# Altium schematic sheet Led RGB.SchDoc
size A4; SheetNumber: 4; SheetTotal: 5
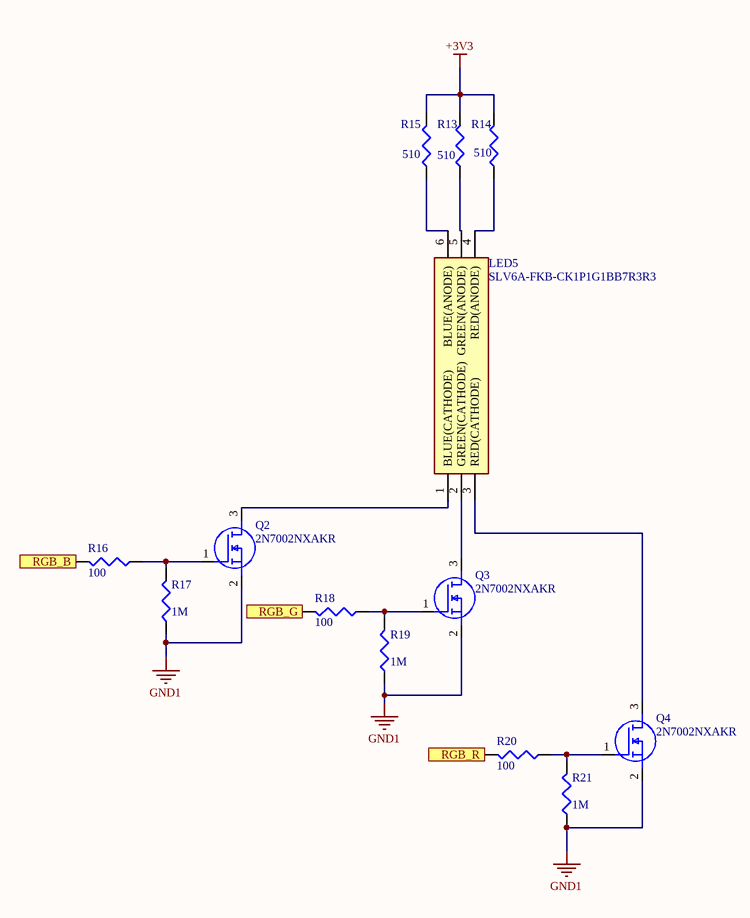
[diagram p0: Led RGB.SchDoc]

## Parts
LED5  SLV6A-FKB-CK1P1G1BB7R3R3  [SLV6AFKBCKNPRGJBB7A363]
Q2  2N7002NXAKR  [SOT95P230X110-3N]
Q3  2N7002NXAKR  [SOT95P230X110-3N]
Q4  2N7002NXAKR  [SOT95P230X110-3N]
R13  value 510  [J1-0603]  (hidden comment: Res3)
R14  value 510  [J1-0603]  (hidden comment: Res3)
R15  value 510  [J1-0603]  (hidden comment: Res3)
R16  value 100  [J1-0603]  (hidden comment: Res3)
R17  value 1M  [J1-0603]  (hidden comment: Res3)
R18  value 100  [J1-0603]  (hidden comment: Res3)
R19  value 1M  [J1-0603]  (hidden comment: Res3)
R20  value 100  [J1-0603]  (hidden comment: Res3)
R21  value 1M  [J1-0603]  (hidden comment: Res3)

## Ports
RGB_B (in), RGB_G (in), RGB_R (in)

## Nets
+3V3: R13.2 R14.2 R15.2
GND1: Q2.2(S) Q3.2(S) Q4.2(S) R17.1 R19.1 R21.1
RGB_B: R16.2 ; port RGB_B
RGB_G: R18.2 ; port RGB_G
RGB_R: R20.2 ; port RGB_R
NetLED5_1: LED5.1(BLUE(CATHODE)) Q2.3(D)
NetLED5_2: LED5.2(GREEN(CATHODE)) Q3.3(D)
NetLED5_3: LED5.3(RED(CATHODE)) Q4.3(D)
NetLED5_4: LED5.4(RED(ANODE)) R14.1
NetLED5_5: LED5.5(GREEN(ANODE)) R13.1
NetLED5_6: LED5.6(BLUE(ANODE)) R15.1
NetQ2_1: Q2.1(G) R16.1 R17.2
NetQ3_1: Q3.1(G) R18.1 R19.2
NetQ4_1: Q4.1(G) R20.1 R21.2

## Library data of the parts
LED5 = SLV6A-FKB-CK1P1G1BB7R3R3: LED; Manufacturer_Name: Cree; Datasheet Link: http://uk.rs-online.com/web/p/products/1684885; Height: 2mm; Manufacturer_Part_Number: SLV6A-FKB-CK1P1G1BB7R3R3; Mouser Part Number: 941-S6AFKBCK1P1G17R3; Mouser Price/Stock: https://www.mouser.co.uk/ProductDetail/Cree-Inc/SLV6A-FKB-CK1P1G1BB7R3R3?qs=6jQbvwb2v93SrlJnkMtIwQ%3D%3D; Arrow Part Number: SLV6A-FKB-CK1P1G1BB7R3R3; Arrow Price/Stock: https://www.arrow.com/en/products/slv6a-fkb-ck1p1g1bb7r3r3/cree
Q2-Q4 = 2N7002NXAKR: MOSFET (N-Channel); Manufacturer_Name: Nexperia; Datasheet Link: https://mouser.componentsearchengine.com/Datasheets/2/2N7002NXAKR.pdf; Height: 1.1mm; Manufacturer_Part_Number: 2N7002NXAKR; Mouser Part Number: 771-2N7002NXAKR; Mouser Price/Stock: https://www.mouser.co.uk/ProductDetail/Nexperia/2N7002NXAKR/?qs=%252B6g0mu59x7JoAsZYPFXqhw%3D%3D; Arrow Part Number: 2N7002NXAKR; Arrow Price/Stock: https://www.arrow.com/en/products/2n7002nxakr/nexperia
R13-R21 = Res3: Resistor; Published: 8-Jun-2000; LatestRevisionDate: 29-May-2009; LatestRevisionNote: IPC-7351 Footprint Added.; PackageReference: J1-0603; Publisher: Altium Limited; PackageDescription: Chip Resistor